# Altium schematic sheet MCU.SchDoc: Title
size A2; Date: Date; CompanyName: Integrated Micro-Electronics Bulgaria; Organization: Design & Development Department; Address1: Drawing Type; Address2: Address 1; Address3: Address 2; Address4: Address 3; DocumentNumber: 730xxx; Revision: 01; SheetNumber: 1; SheetTotal: 1; PageSetup: Record=PageOptions|CenterHorizontal=True|CenterVertical=True|PrintScale=0.70|XCorrection=1.00|YCorrection=1.00|PrintKind=2|BorderSize=5000000|LeftOffset=0|BottomOffset=0|Orientation=2|PaperLength=1000|PaperWidth=1000|Scale=100|PaperSource=7|PrintQuality=-4|MediaType=1|DitherType=10|PaperKind=A4|PrintScaleMode=1; SheetSize: A3; Time: Time; ModifiedDate: Mod. Date
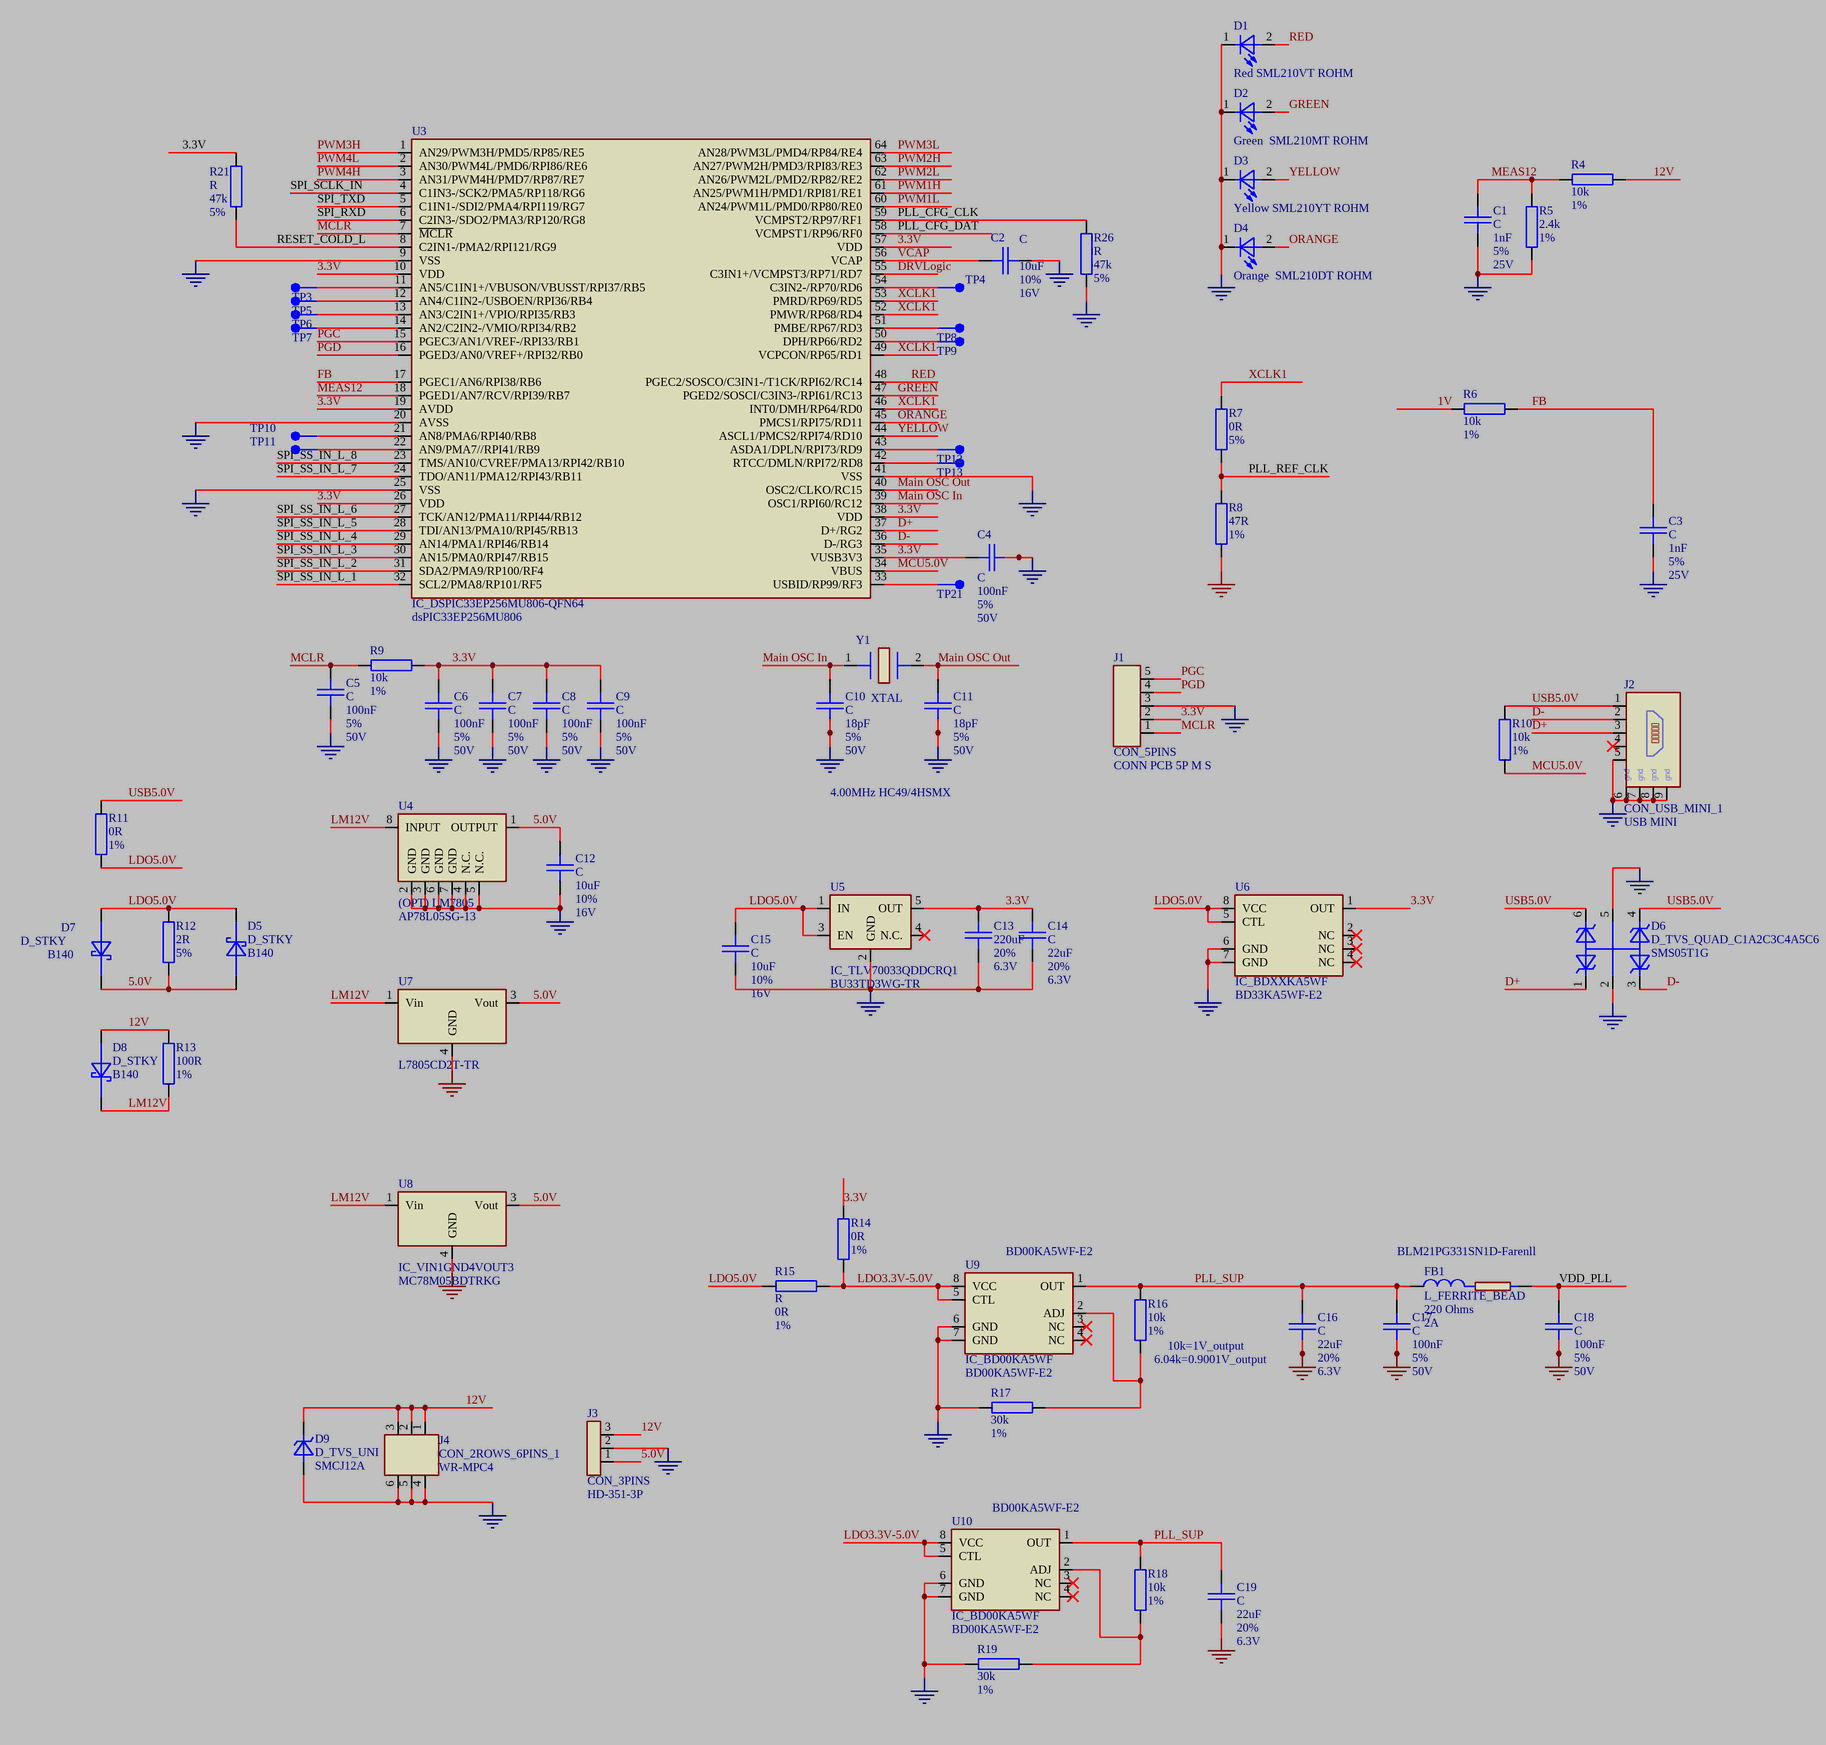
[diagram p0: MCU.SchDoc]

## Parts
C1  C  DB_VALUE: 1nF  DB_TOLERANCE: 5%  DB_VOLTAGE: 25V  [SMD_0603_CAPC1608X95N]
C2  C  DB_VALUE: 10uF  DB_TOLERANCE: 10%  DB_VOLTAGE: 16V  [SMD_0805_CAPC2012X145N]
C3  C  DB_VALUE: 1nF  DB_TOLERANCE: 5%  DB_VOLTAGE: 25V  [SMD_0603_CAPC1608X95N]
C4  C  DB_VALUE: 100nF  DB_TOLERANCE: 5%  DB_VOLTAGE: 50V  [SMD_0603_CAPC1608X95N]
C5  C  DB_VALUE: 100nF  DB_TOLERANCE: 5%  DB_VOLTAGE: 50V  [SMD_0603_CAPC1608X95N]
C6  C  DB_VALUE: 100nF  DB_TOLERANCE: 5%  DB_VOLTAGE: 50V  [SMD_0603_CAPC1608X95N]
C7  C  DB_VALUE: 100nF  DB_TOLERANCE: 5%  DB_VOLTAGE: 50V  [SMD_0603_CAPC1608X95N]
C8  C  DB_VALUE: 100nF  DB_TOLERANCE: 5%  DB_VOLTAGE: 50V  [SMD_0603_CAPC1608X95N]
C9  C  DB_VALUE: 100nF  DB_TOLERANCE: 5%  DB_VOLTAGE: 50V  [SMD_0603_CAPC1608X95N]
C10  C  DB_VALUE: 18pF  DB_TOLERANCE: 5%  DB_VOLTAGE: 50V  [SMD_0603_CAPC1608X95N]
C11  C  DB_VALUE: 18pF  DB_TOLERANCE: 5%  DB_VOLTAGE: 50V  [SMD_0603_CAPC1608X95N]
C12  C  DB_VALUE: 10uF  DB_TOLERANCE: 10%  DB_VOLTAGE: 16V  [SMD_0805_CAPC2012X145N]
C13  DB_VALUE: 220uF  DB_TOLERANCE: 20%  DB_VOLTAGE: 6.3V  [SMD_1210_CAPC3225X279N]  (hidden comment: C)
C14  C  DB_VALUE: 22uF  DB_TOLERANCE: 20%  DB_VOLTAGE: 6.3V  [SMD_0805_CAPC2012X145N]
C15  C  DB_VALUE: 10uF  DB_TOLERANCE: 10%  DB_VOLTAGE: 16V  [SMD_0805_CAPC2012X145N]
C16  C  DB_VALUE: 22uF  DB_TOLERANCE: 20%  DB_VOLTAGE: 6.3V  [SMD_0805_CAPC2012X145N]
C17  C  DB_VALUE: 100nF  DB_TOLERANCE: 5%  DB_VOLTAGE: 50V  [SMD_0603_CAPC1608X95N]
C18  C  DB_VALUE: 100nF  DB_TOLERANCE: 5%  DB_VOLTAGE: 50V  [SMD_0603_CAPC1608X95N]
C19  C  DB_VALUE: 22uF  DB_TOLERANCE: 20%  DB_VOLTAGE: 6.3V  [SMD_0805_CAPC2012X145N]
D1  Red SML210VT ROHM  [SMD_0805_LED2012X100N]
D2  Green 	SML210MT ROHM  [SMD_0805_LED2012X100N]
D3  Yellow SML210YT ROHM  [SMD_0805_LED2012X100N]
D4  Orange 	SML210DT ROHM  [SMD_0805_LED2012X100N]
D5  D_STKY  DB_VALUE: B140  [SMD_DO214AC_SMA]
D6  D_TVS_QUAD_C1A2C3C4A5C6  DB_VALUE: SMS05T1G  [SMD_SOT457_SOT95P275X110-6N]
D7  D_STKY  DB_VALUE: B140  [SMD_DO214AC_SMA]
D8  D_STKY  DB_VALUE: B140  [SMD_DO214AC_SMA]
D9  D_TVS_UNI  DB_VALUE: SMCJ12A  [SMD_DO214AC_SMC]
FB1  L_FERRITE_BEAD  DB_VALUE: 220 Ohms  DB_CURRENT: 2A  [SMD_0805_INDC2012X105N]
J1  CON_5PINS  DB_VALUE: CONN PCB 5P M S  [PTH_HDRV05W64P254_1X05]
J2  CON_USB_MINI_1  DB_VALUE: USB MINI  [SMD_CON-CVILUX-CU04-SCM15B0]
J3  CON_3PINS  DB_VALUE: HD-351-3P  [PTH_CON_HD-351-3P]
J4  CON_2ROWS_6PINS_1  DB_VALUE: WR-MPC4  [PTH_CON_WR-MRC4-6P]
R4  DB_VALUE: 10k  DB_TOLERANCE: 1%  [SMD_0603_RESC1608X55N]  (hidden comment: R)
R5  DB_VALUE: 2.4k  DB_TOLERANCE: 1%  [SMD_0603_RESC1608X55N]  (hidden comment: R)
R6  DB_VALUE: 10k  DB_TOLERANCE: 1%  [SMD_0603_RESC1608X55N]  (hidden comment: R)
R7  DB_VALUE: 0R  DB_TOLERANCE: 5%  [SMD_0603_RESC1608X55N]  (hidden comment: R)
R8  DB_VALUE: 47R  DB_TOLERANCE: 1%  [SMD_0603_RESC1608X55N]  (hidden comment: R)
R9  DB_VALUE: 10k  DB_TOLERANCE: 1%  [SMD_0603_RESC1608X55N]  (hidden comment: R)
R10  DB_VALUE: 10k  DB_TOLERANCE: 1%  [SMD_0603_RESC1608X55N]  (hidden comment: R)
R11  DB_VALUE: 0R  DB_TOLERANCE: 1%  [SMD_0603_RESC1608X55N]  (hidden comment: R)
R12  DB_VALUE: 2R  DB_TOLERANCE: 5%  [SMD_1206_RESC3216X65N]  (hidden comment: R)
R13  DB_VALUE: 100R  DB_TOLERANCE: 1%  [SMD_1206_RESC3216X65N]  (hidden comment: R)
R14  DB_VALUE: 0R  DB_TOLERANCE: 1%  [SMD_1206_RESC3216X65N]  (hidden comment: R)
R15  R  DB_VALUE: 0R  DB_TOLERANCE: 1%  [SMD_1206_RESC3216X65N]
R16  DB_VALUE: 10k  DB_TOLERANCE: 1%  [SMD_0603_RESC1608X55N]  (hidden comment: R)
R17  DB_VALUE: 30k  DB_TOLERANCE: 1%  [SMD_0603_RESC1608X55N]  (hidden comment: R)
R18  DB_VALUE: 10k  DB_TOLERANCE: 1%  [SMD_0603_RESC1608X55N]  (hidden comment: R)
R19  DB_VALUE: 30k  DB_TOLERANCE: 1%  [SMD_0603_RESC1608X55N]  (hidden comment: R)
R21  R  DB_VALUE: 47k  DB_TOLERANCE: 5%  [SMD_0603_RESC1608X55N]
R26  R  DB_VALUE: 47k  DB_TOLERANCE: 5%  [SMD_0603_RESC1608X55N]
TP3  TEST_POINT_1  [SMD_TP_100-254]  (value not drawn)
TP4  TEST_POINT_1  [SMD_TP_100-254]  (value not drawn)
TP5  TEST_POINT_1  [SMD_TP_100-254]  (value not drawn)
TP6  TEST_POINT_1  [SMD_TP_100-254]  (value not drawn)
TP7  TEST_POINT_1  [SMD_TP_100-254]  (value not drawn)
TP8  TEST_POINT_1  [SMD_TP_100-254]  (value not drawn)
TP9  TEST_POINT_1  [SMD_TP_100-254]  (value not drawn)
TP10  TEST_POINT_1  [SMD_TP_100-254]  (value not drawn)
TP11  TEST_POINT_1  [SMD_TP_100-254]  (value not drawn)
TP12  TEST_POINT_1  [SMD_TP_100-254]  (value not drawn)
TP13  TEST_POINT_1  [SMD_TP_100-254]  (value not drawn)
TP21  TEST_POINT_1  [SMD_TP_100-254]  (value not drawn)
U3  IC_DSPIC33EP256MU806-QFN64  DB_VALUE: dsPIC33EP256MU806  [SMD_QFP50P1200X1200X120-64N]
U4  (OPT) LM7805  DB_VALUE: AP78L05SG-13  [SMD_SOIC127P600X175-8N]
U5  IC_TLV70033QDDCRQ1  DB_VALUE: BU33TD3WG-TR  [SMD_SOT95P280X135-5N]
U6  IC_BDXXKA5WF  DB_VALUE: BD33KA5WF-E2  [SMD_SOIC127P620X160-8N]
U7  DB_VALUE: L7805CD2T-TR  [SMD_TO254P1542X460-3_4N]  (hidden comment: IC_IN1OUT3GND4)
U8  IC_VIN1GND4VOUT3  DB_VALUE: MC78M05BDTRKG  [SMD_TO229P991X239-4N_DPAK]
U9  IC_BD00KA5WF  DB_VALUE: BD00KA5WF-E2  [SMD_SOIC127P620X160-8N]
U10  IC_BD00KA5WF  DB_VALUE: BD00KA5WF-E2  [SMD_SOIC127P620X160-8N]
Y1  XTAL  DB_VALUE: 4.00MHz HC49/4HSMX  [SMD_HC49_XTAL1140X480X420N]

## Nets
GND: C1.2 C2.2 C3.2 C4.2 C5.2 C6.2 C7.2 C8.2 C9.2 C10.2 C11.2 C12.2 C13.1 C14.2 C15.2 C16.2 C17.2 C18.2 C19.2 D1.1(C) D2.1(C) D3.1(C) D4.1(C) D6.2 D6.5 D9.2(A) J1.3 J2.5 J2.6 J2.7 J2.8 J2.9 J3.2 J4.4 J4.5 J4.6 R5.1 R8.2 R17.2 R19.2 R26.2 U3.9(VSS) U3.20(AVSS) U3.25(VSS) U3.41(VSS) U4.2(GND) U4.3(GND) U4.4(N.C.) U4.5(N.C.) U4.6(GND) U4.7(GND) U5.2(GND) U6.6(GND) U6.7(GND) U7.4(GND) U8.4(GND) U9.6(GND) U9.7(GND) U10.6(GND) U10.7(GND)
1V: R6.2
3.3V: C4.1 C6.1 C7.1 C8.1 C9.1 C13.2 C14.1 J1.2 R9.2 R14.2 R21.1 U3.10(VDD) U3.19(AVDD) U3.26(VDD) U3.35(VUSB3V3) U3.38(VDD) U3.57(VDD) U5.5(OUT) U6.1(OUT)
5.0V: C12.1 D5.2(A) D7.1(C) J3.1 R12.1 U4.1(OUTPUT) U7.3(Vout) U8.3(Vout)
12V: D8.2(A) D9.1(C) J3.3 J4.1 J4.2 J4.3 R4.1 R13.2
D+: D6.1 J2.3 U3.37(D+/RG2)
D-: D6.3 J2.2 U3.36(D-/RG3)
DRVLogic: U3.55(C3IN1+/VCMPST3/RP71/RD7)
FB: C3.1 R6.1 U3.17(PGEC1/AN6/RPI38/RB6)
GREEN: D2.2(A) U3.47(PGED2/SOSCI/C3IN3-/RPI61/RC13)
LDO3.3V-5.0V: R14.1 R15.1 U9.5(CTL) U9.8(VCC) U10.5(CTL) U10.8(VCC)
LDO5.0V: C15.1 D5.1(C) D7.2(A) R11.1 R12.2 R15.2 U5.1(IN) U5.3(EN) U6.5(CTL) U6.8(VCC)
LM12V: D8.1(C) R13.1 U4.8(INPUT) U7.1(Vin) U8.1(Vin)
Main OSC In: C10.1 U3.39(OSC1/RPI60/RC12) Y1.1
Main OSC Out: C11.1 U3.40(OSC2/CLKO/RC15) Y1.2
MCLR: C5.1 J1.1 R9.1 U3.7(~{MCLR})
MCU5.0V: R10.2 U3.34(VBUS)
MEAS12: C1.1 R4.2 R5.2 U3.18(PGED1/AN7/RCV/RPI39/RB7)
ORANGE: D4.2(A) U3.45(PMCS1/RPI75/RD11)
PGC: J1.5 U3.15(PGEC3/AN1/VREF-/RPI33/RB1)
PGD: J1.4 U3.16(PGED3/AN0/VREF+/RPI32/RB0)
PLL_CFG_CLK: R26.1 U3.59(VCMPST2/RP97/RF1)
PLL_CFG_DAT: U3.58(VCMPST1/RP96/RF0)
PLL_REF_CLK: R7.1 R8.1
PLL_SUP: C16.1 C17.1 C19.1 FB1.1 R16.1 R18.1 U9.1(OUT) U10.1(OUT)
PWM1H: U3.61(AN25/PWM1H/PMD1/RPI81/RE1)
PWM1L: U3.60(AN24/PWM1L/PMD0/RP80/RE0)
PWM2H: U3.63(AN27/PWM2H/PMD3/RPI83/RE3)
PWM2L: U3.62(AN26/PWM2L/PMD2/RP82/RE2)
PWM3H: U3.1(AN29/PWM3H/PMD5/RP85/RE5)
PWM3L: U3.64(AN28/PWM3L/PMD4/RP84/RE4)
PWM4H: U3.3(AN31/PWM4H/PMD7/RP87/RE7)
PWM4L: U3.2(AN30/PWM4L/PMD6/RPI86/RE6)
RED: D1.2(A) U3.48(PGEC2/SOSCO/C3IN1-/T1CK/RPI62/RC14)
RESET_COLD_L: R21.2 U3.8(C2IN1-/PMA2/RPI121/RG9)
SPI_RXD: U3.6(C2IN3-/SDO2/PMA3/RP120/RG8)
SPI_SCLK_IN: U3.4(C1IN3-/SCK2/PMA5/RP118/RG6)
SPI_SS_IN_L_1: U3.32(SCL2/PMA8/RP101/RF5)
SPI_SS_IN_L_2: U3.31(SDA2/PMA9/RP100/RF4)
SPI_SS_IN_L_3: U3.30(AN15/PMA0/RPI47/RB15)
SPI_SS_IN_L_4: U3.29(AN14/PMA1/RPI46/RB14)
SPI_SS_IN_L_5: U3.28(TDI/AN13/PMA10/RPI45/RB13)
SPI_SS_IN_L_6: U3.27(TCK/AN12/PMA11/RPI44/RB12)
SPI_SS_IN_L_7: U3.24(TDO/AN11/PMA12/RPI43/RB11)
SPI_SS_IN_L_8: U3.23(TMS/AN10/CVREF/PMA13/RPI42/RB10)
SPI_TXD: U3.5(C1IN1-/SDI2/PMA4/RPI119/RG7)
USB5.0V: D6.4 D6.6 J2.1 R10.1 R11.2
VCAP: C2.1 U3.56(VCAP)
VDD_PLL: C18.1 FB1.2
XCLK1: R7.2 U3.46(INT0/DMH/RP64/RD0) U3.49(VCPCON/RP65/RD1) U3.52(PMWR/RP68/RD4) U3.53(PMRD/RP69/RD5)
YELLOW: D3.2(A) U3.44(ASCL1/PMCS2/RPI74/RD10)
NetR16_2: R16.2 R17.1 U9.2(ADJ)
NetR18_2: R18.2 R19.1 U10.2(ADJ)
NetTP3_1: TP3.1 U3.11(AN5/C1IN1+/VBUSON/VBUSST/RPI37/RB5)
NetTP4_1: TP4.1 U3.54(C3IN2-/RP70/RD6)
NetTP5_1: TP5.1 U3.12(AN4/C1IN2-/USBOEN/RPI36/RB4)
NetTP6_1: TP6.1 U3.13(AN3/C2IN1+/VPIO/RPI35/RB3)
NetTP7_1: TP7.1 U3.14(AN2/C2IN2-/VMIO/RPI34/RB2)
NetTP8_1: TP8.1 U3.51(PMBE/RP67/RD3)
NetTP9_1: TP9.1 U3.50(DPH/RP66/RD2)
NetTP10_1: TP10.1 U3.21(AN8/PMA6/RPI40/RB8)
NetTP11_1: TP11.1 U3.22(AN9/PMA7//RPI41/RB9)
NetTP12_1: TP12.1 U3.43(ASDA1/DPLN/RPI73/RD9)
NetTP13_1: TP13.1 U3.42(RTCC/DMLN/RPI72/RD8)
NetTP21_1: TP21.1 U3.33(USBID/RP99/RF3)

Not connected (* = marked no-connect by the designer): J2 4*; U5 4(N.C.)*; U6 2(NC)* 3(NC)* 4(NC)*; U9 3(NC)* 4(NC)*; U10 3(NC)* 4(NC)*

## Notes on the sheet
- (near U9) BD00KA5WF-E2
- (near FB1) BLM21PG331SN1D-Farenll
- 6.04k=0.9001V_output
- (near R16) 10k=1V_output
- (near U10) BD00KA5WF-E2
- (in symbol CON000000048) gnd

## Library data of the parts
C1 C3 = CAP000024113: DB_PART_TYPE: Ceramic_SMD\Standard_X7R; DB_MANUFACTURER_PART: KEMET    C0603C102J3RAC; NOTE: <NOTE>; DB_T_RANGE: -55 to 125; DB_PACKAGE: 0603; DB_DESCRIPTION: C X7R 1nF 5% 25V 0603; DB_CERTIFIED: ISHIDDEN=T; DB_STATUS: NEW; DB_PART_NUMBER: CAP000024113; DB_PCB_DEVICE: SMD_0603_CAPC1608X95N; DB_PRICE: ISHIDDEN=T; DB_LEADTIME: ISHIDDEN=T; DB_MOQ: ISHIDDEN=T; DB_PRICE_DATE: ISHIDDEN=T; DB_APPROVED_BY: ISHIDDEN=T; DB_APPROVED_ON: 09.10.2010; DB_DATASHEET: http://john.epiqdesign.com/projects/CIS_Datasheets/F3102_CE_Kemet.pdf?rev=92&sc=0
C2 C12 C15 = CAP000043636: DB_PART_TYPE: Ceramic_SMD\Standard_X5R; DB_MANUFACTURER_PART: KEMET    C0805C106K4PAC; NOTE: <NOTE>; DB_T_RANGE: -55 to 85; DB_PACKAGE: 0805; DB_DESCRIPTION: C X5R 10uF 10% 16V 0805; DB_CERTIFIED: ISHIDDEN=T; DB_STATUS: NEW; DB_PART_NUMBER: CAP000043636; DB_PCB_DEVICE: SMD_0805_CAPC2012X145N; DB_PRICE: ISHIDDEN=T; DB_LEADTIME: ISHIDDEN=T; DB_MOQ: ISHIDDEN=T; DB_PRICE_DATE: ISHIDDEN=T; DB_APPROVED_BY: ISHIDDEN=T; DB_APPROVED_ON: 09.10.2010; DB_DATASHEET: http://john.epiqdesign.com/projects/CIS_Datasheets/F3102_CE_Kemet.pdf?rev=92&sc=0
C4-C9 C17 C18 = CAP000027136: DB_PART_TYPE: Ceramic_SMD\Standard_X7R; DB_MANUFACTURER_PART: KEMET    C0603C104J5RAC; NOTE: <NOTE>; DB_T_RANGE: -55 to 125; DB_PACKAGE: 0603; DB_DESCRIPTION: C X7R 100nF 5% 50V 0603; DB_CERTIFIED: ISHIDDEN=T; DB_STATUS: NEW; DB_PART_NUMBER: CAP000027136; DB_PCB_DEVICE: SMD_0603_CAPC1608X95N; DB_PRICE: ISHIDDEN=T; DB_LEADTIME: ISHIDDEN=T; DB_MOQ: ISHIDDEN=T; DB_PRICE_DATE: ISHIDDEN=T; DB_APPROVED_BY: ISHIDDEN=T; DB_APPROVED_ON: 09.10.2010; DB_DATASHEET: http://john.epiqdesign.com/projects/CIS_Datasheets/F3102_CE_Kemet.pdf?rev=92&sc=0
C10 C11 = CAP000031922: DB_PART_TYPE: Ceramic_SMD\Standard_C0G; DB_MANUFACTURER_PART: KEMET    C0603C180J5GAC; NOTE: <NOTE>; DB_T_RANGE: -55 to 125; DB_PACKAGE: 0603; DB_DESCRIPTION: C C0G 18pF 5% 50V 0603; DB_CERTIFIED: ISHIDDEN=T; DB_STATUS: NEW; DB_PART_NUMBER: CAP000031922; DB_PCB_DEVICE: SMD_0603_CAPC1608X95N; DB_PRICE: ISHIDDEN=T; DB_LEADTIME: ISHIDDEN=T; DB_MOQ: ISHIDDEN=T; DB_PRICE_DATE: ISHIDDEN=T; DB_APPROVED_BY: ISHIDDEN=T; DB_APPROVED_ON: 09.10.2010; DB_DATASHEET: http://john.epiqdesign.com/projects/CIS_Datasheets/F3102_CE_Kemet.pdf?rev=92&sc=0
C13 = CAP000047355: DB_PART_TYPE: Ceramic_SMD\Standard_X5R; DB_MANUFACTURER_PART: SAMSUNG    CL32A227MQVNNNE; NOTE: <NOTE>; DB_T_RANGE: -55 to 85; DB_PACKAGE: 1210; DB_DESCRIPTION: C X5R 220uF 20% 6.3V 1210; DB_CERTIFIED: ISHIDDEN=T; DB_APPROVED_BY: VSN; DB_STATUS: NEW; DB_PART_NUMBER: CAP000047355; DB_PCB_DEVICE: SMD_1210_CAPC3225X279N; DB_APPROVED_ON: 07.05.2014 11:28:08; DB_DATASHEET: http://john.epiqdesign.com/projects/CIS_Datasheets/CAP_CL32A227MQVNNNE.pdf?rev=1401&sc=0
C14 C16 C19 = CAP000043686: DB_PART_TYPE: Ceramic_SMD\Standard_X5R; DB_MANUFACTURER_PART: KEMET    C0805C226M9PAC; NOTE: <NOTE>; DB_T_RANGE: -55 to 85; DB_PACKAGE: 0805; DB_DESCRIPTION: C X5R 22uF 20% 6.3V 0805; DB_CERTIFIED: ISHIDDEN=T; DB_STATUS: NEW; DB_PART_NUMBER: CAP000043686; DB_PCB_DEVICE: SMD_0805_CAPC2012X145N; DB_PRICE: ISHIDDEN=T; DB_LEADTIME: ISHIDDEN=T; DB_MOQ: ISHIDDEN=T; DB_PRICE_DATE: ISHIDDEN=T; DB_APPROVED_BY: ISHIDDEN=T; DB_APPROVED_ON: 09.10.2010; DB_DATASHEET: http://john.epiqdesign.com/projects/CIS_Datasheets/F3102_CE_Kemet.pdf?rev=92&sc=0
D1-D4 = LED_2: NOTE: <NOTE>; DB_PCB_DEVICE: SMD_0805_LED2012X100N
D5 D7 D8 = DDE000000580: DB_PART_TYPE: Schottky; DB_MANUFACTURER_PART: Diodes        B140; NOTE: <NOTE>; DB_T_RANGE: -65 to +150; DB_VOLTAGE: 40V; DB_CURRENT: 1A; DB_PACKAGE: SMA; DB_DESCRIPTION: D B140 SMA; DB_CERTIFIED: ISHIDDEN=T; DB_STATUS: NEW; DB_PART_NUMBER: DDE000000580; DB_PCB_DEVICE: SMD_DO214AC_SMA; DB_PRICE: ISHIDDEN=T; DB_LEADTIME: ISHIDDEN=T; DB_MOQ: ISHIDDEN=T; DB_PRICE_DATE: ISHIDDEN=T; DB_APPROVED_BY: ISHIDDEN=T; DB_APPROVED_ON: 09.10.2010; DB_DATASHEET: ISHIDDEN=T
D6 = DDE000002846: DB_PART_TYPE: ESD protection; DB_MANUFACTURER_PART: ON SEMICONDUCTOR        SMS05T1G; DB_T_RANGE: -55 to 150; DB_VOLTAGE: 5V; DB_PACKAGE: SC-74; DB_DESCRIPTION: D SMS05T1G SC-74; DB_CERTIFIED: ISHIDDEN=T; DB_APPROVED_BY: VSN; DB_STATUS: NEW; DB_PART_NUMBER: DDE000002846; DB_PCB_DEVICE: SMD_SOT457_SOT95P275X110-6N; DB_APPROVED_ON: 24.03.2014 10:22:08; DB_DATASHEET: http://john.epiqdesign.com/projects/CIS_Datasheets/IC_SMS05T1-D.pdf?rev=1323&sc=0
D9 = DDE000001725: DB_PART_TYPE: TVS; DB_MANUFACTURER_PART: Diodes        SMCJ12A; NOTE: <NOTE>; DB_T_RANGE: -55 to 150; DB_VOLTAGE: 12V; DB_CURRENT: 75A(Max); DB_PACKAGE: SMC; DB_DESCRIPTION: D SMCJ12A SMC; DB_CERTIFIED: ISHIDDEN=T; DB_STATUS: NEW; DB_PART_NUMBER: DDE000001725; DB_PCB_DEVICE: SMD_DO214AC_SMC; DB_PRICE: ISHIDDEN=T; DB_LEADTIME: ISHIDDEN=T; DB_MOQ: ISHIDDEN=T; DB_PRICE_DATE: ISHIDDEN=T; DB_APPROVED_BY: ISHIDDEN=T; DB_APPROVED_ON: 09.10.2010; DB_DATASHEET: ISHIDDEN=T
FB1 = IND000000029: DB_PART_TYPE: Inductor; DB_MANUFACTURER_PART: MURATA       BLM21PG221SN1D; NOTE: <NOTE>; DB_TOLERANCE: 25%; DB_T_RANGE: -55 to 125; DB_PACKAGE: 0805; DB_DESCRIPTION: INDUC 220 Ohms 25% 0805; DB_CERTIFIED: ISHIDDEN=T; DB_APPROVED_BY: VSN; DB_STATUS: NEW; DB_PART_NUMBER: IND000000029; DB_PCB_DEVICE: SMD_0805_INDC2012X105N; DB_PRICE: ISHIDDEN=T; DB_LEADTIME: ISHIDDEN=T; DB_MOQ: ISHIDDEN=T; DB_PRICE_DATE: ISHIDDEN=T; DB_APPROVED_ON: 30.06.2011 07:59:29; DB_DATASHEET: http://john.epiqdesign.com/projects/CIS_Datasheets/BLM21P_MURATA.pdf?rev=325&sc=0
J1 = CON000000006: DB_PART_TYPE: Connector; DB_MANUFACTURER_PART: W+P        143-12-005-00; NOTE: <NOTE>; DB_PINS_NUMBER: ISHIDDEN=T; DB_T_RANGE: -55 to 125; DB_PACKAGE: PTH; DB_DESCRIPTION: CONN PCB 5P M S 143-12-005-00; DB_APPROVED_BY: VSN; DB_STATUS: NEW; DB_PART_NUMBER: CON000000006; DB_PITCH: ISHIDDEN=T; DB_VOLTAGE: ISHIDDEN=T; DB_CURRENT: ISHIDDEN=T; DB_IP_CLASS: ISHIDDEN=T; DB_PCB_DEVICE: PTH_HDRV05W64P254_1X05; DB_CERTIFIED: ISHIDDEN=T; DB_PRICE: ISHIDDEN=T; DB_LEADTIME: ISHIDDEN=T; DB_MOQ: ISHIDDEN=T; DB_PRICE_DATE: ISHIDDEN=T; DB_APPROVED_ON: 14.12.2010 10:22:07; DB_DATASHEET: http://john.epiqdesign.com/projects/CIS_Datasheets/143-12-005-00_W+P.pdf?rev=3&sc=0
J2 = CON000000048: DB_PART_TYPE: Connector; DB_MANUFACTURER_PART: CVILUX       CU04-SCM15B0-R0-LF; NOTE: <NOTE>; DB_PINS_NUMBER: 5; DB_PITCH: 0.8; DB_PACKAGE: SMD; DB_DESCRIPTION: CONN  PCB  5P  F  A  USB5 MINI SMD; DB_CERTIFIED: ISHIDDEN=T; DB_APPROVED_BY: VSN; DB_STATUS: NEW; DB_PART_NUMBER: CON000000048; DB_PCB_DEVICE: SMD_CON-CVILUX-CU04-SCM15B0; DB_PRICE: ISHIDDEN=T; DB_LEADTIME: ISHIDDEN=T; DB_MOQ: ISHIDDEN=T; DB_PRICE_DATE: ISHIDDEN=T; DB_APPROVED_ON: 02.05.2011 10:29:38; DB_DATASHEET: http://john.epiqdesign.com/projects/CIS_Datasheets/USB%20MINI_CVILUX.pdf?rev=249&sc=0
J3 = CON000000272: DB_PART_TYPE: Connector; DB_MANUFACTURER_PART: HOW DER      HD-351-3P; DB_PINS_NUMBER: 3; DB_PITCH: 3.5mm; DB_VOLTAGE: 300VAC; DB_CURRENT: 10A; DB_PACKAGE: PTH; DB_DESCRIPTION: CONN PCB 3P; DB_CERTIFIED: ISHIDDEN=T; DB_APPROVED_BY: VSN; DB_STATUS: NEW; DB_PART_NUMBER: CON000000272; DB_PCB_DEVICE: PTH_CON_HD-351-3P; DB_APPROVED_ON: 07.05.2014 14:06:04; DB_DATASHEET: http://john.epiqdesign.com/projects/CIS_Datasheets/CON_hd-351.pdf?rev=1413&sc=0
J4 = CON000000271: DB_PART_TYPE: Connector; DB_MANUFACTURER_PART: WE         649 006 295 22; DB_PINS_NUMBER: 6; DB_PITCH: 4.2mm; DB_T_RANGE: -40 to 105; DB_VOLTAGE: 600VAC; DB_CURRENT: 6 - 9A; DB_PACKAGE: PTH; DB_DESCRIPTION: CONN PCB 6P M A PTH; DB_CERTIFIED: ISHIDDEN=T; DB_APPROVED_BY: VSN; DB_STATUS: NEW; DB_PART_NUMBER: CON000000271; DB_PCB_DEVICE: PTH_CON_WR-MRC4-6P; DB_APPROVED_ON: 07.05.2014 13:56:56; DB_DATASHEET: http://john.epiqdesign.com/projects/CIS_Datasheets/CON_WR-MPC4.pdf?rev=1412&sc=0
R4 R6 R9 R10 R16 R18 = RES000008663: DB_PART_TYPE: SMD; DB_MANUFACTURER_PART: YAGEO    RC0603FR-0710KL; NOTE: <NOTE>; DB_T_RANGE: -55 to 155; DB_POWER: 1/10W; DB_PACKAGE: 0603; DB_DESCRIPTION: R SMD 10k 1% 1/10W 0603; DB_CERTIFIED: ISHIDDEN=T; DB_APPROVED_BY: VSN; DB_STATUS: NEW; R_BDS: R; DB_PART_NUMBER: RES000008663; DB_PCB_DEVICE: SMD_0603_RESC1608X55N; DB_PRICE: ISHIDDEN=T; DB_LEADTIME: ISHIDDEN=T; DB_MOQ: ISHIDDEN=T; DB_PRICE_DATE: ISHIDDEN=T; DB_APPROVED_ON: 08.08.2011 08:31:51; DB_DATASHEET: http://john.epiqdesign.com/projects/CIS_Datasheets/PYu-RC0603_51_RoHS_L_4_YAGEO.pdf?rev=138&sc=0
R5 = RES000006261: DB_PART_TYPE: SMD; DB_MANUFACTURER_PART: YAGEO    RC0603FR-072K4; NOTE: <NOTE>; DB_T_RANGE: -55 to 155; DB_POWER: 1/10W; DB_PACKAGE: 0603; DB_DESCRIPTION: R SMD 2K4 1% 1/10W 0603; DB_CERTIFIED: ISHIDDEN=T; DB_PRICE: 0.00063; DB_MOQ: 5000; DB_STATUS: NEW; R_BDS: R; DB_PART_NUMBER: RES000006261; DB_PCB_DEVICE: SMD_0603_RESC1608X55N; DB_PRICE_DATE: 2010-12-23; DB_APPROVED_BY: ISHIDDEN=T; DB_APPROVED_ON: 09.10.2010; DB_DATASHEET: http://john.epiqdesign.com/projects/CIS_Datasheets/PYu-RC0603_51_RoHS_L_4_YAGEO.pdf?rev=138&sc=0
R7 = RES000006349: DB_PART_TYPE: SMD; DB_MANUFACTURER_PART: YAGEO    RC0603JR-070R; NOTE: <NOTE>; DB_T_RANGE: -55 to 155; DB_POWER: 1/10W; DB_PACKAGE: 0603; DB_DESCRIPTION: R SMD 0R 5% 1/10W 0603; DB_PRICE: 0.000364; DB_MOQ: 5000; DB_STATUS: NEW; R_BDS: R; DB_PART_NUMBER: RES000006349; DB_PCB_DEVICE: SMD_0603_RESC1608X55N; DB_PRICE_DATE: 2010-12-23; DB_APPROVED_ON: 09.10.2010; DB_DATASHEET: http://john.epiqdesign.com/projects/CIS_Datasheets/PYu-RC0603_51_RoHS_L_4_YAGEO.pdf?rev=138&sc=0
R8 = RES000006220: DB_PART_TYPE: SMD; DB_MANUFACTURER_PART: YAGEO    RC0603FR-0747R; NOTE: <NOTE>; DB_T_RANGE: -55 to 155; DB_POWER: 1/10W; DB_PACKAGE: 0603; DB_DESCRIPTION: R SMD 47R 1% 1/10W 0603; DB_CERTIFIED: ISHIDDEN=T; DB_PRICE: 0.00063; DB_MOQ: 5000; DB_STATUS: NEW; R_BDS: R; DB_PART_NUMBER: RES000006220; DB_PCB_DEVICE: SMD_0603_RESC1608X55N; DB_PRICE_DATE: 2010-12-23; DB_APPROVED_BY: ISHIDDEN=T; DB_APPROVED_ON: 09.10.2010; DB_DATASHEET: http://john.epiqdesign.com/projects/CIS_Datasheets/PYu-RC0603_51_RoHS_L_4_YAGEO.pdf?rev=138&sc=0
R11 = RES000008926: DB_PART_TYPE: SMD; DB_MANUFACTURER_PART: YAGEO    AC0603FR-070RL; NOTE: <NOTE>; DB_T_RANGE: -55 to 155; DB_POWER: 1/10W; DB_PACKAGE: 0603; DB_DESCRIPTION: R SMD 0R 1% 1/10W 0603; DB_CERTIFIED: AUT; DB_APPROVED_BY: VSN; DB_STATUS: NEW; R_BDS: R; DB_PART_NUMBER: RES000008926; DB_PCB_DEVICE: SMD_0603_RESC1608X55N; DB_APPROVED_ON: 21.05.2013 09:19:53; DB_DATASHEET: http://john.epiqdesign.com/projects/CIS_Datasheets/RES_AC_YAGEO.pdf?rev=263&sc=0
R12 = RES000007051: DB_PART_TYPE: SMD; DB_MANUFACTURER_PART: YAGEO    RC1206JR-072R; NOTE: <NOTE>; DB_T_RANGE: -55 to 155; DB_POWER: 1/4W; DB_PACKAGE: 1206; DB_DESCRIPTION: R SMD 2R 5% 1/4W 1206; DB_CERTIFIED: ISHIDDEN=T; DB_STATUS: NEW; R_BDS: R; DB_PART_NUMBER: RES000007051; DB_PCB_DEVICE: SMD_1206_RESC3216X65N; DB_PRICE: ISHIDDEN=T; DB_LEADTIME: ISHIDDEN=T; DB_MOQ: ISHIDDEN=T; DB_PRICE_DATE: ISHIDDEN=T; DB_APPROVED_BY: ISHIDDEN=T; DB_APPROVED_ON: 09.10.2010; DB_DATASHEET: http://john.epiqdesign.com/projects/CIS_Datasheets/PYu-RC1206_51_RoHS_L_4_YAGEO.pdf?rev=138&sc=0
R13 = RES000006922: DB_PART_TYPE: SMD; DB_MANUFACTURER_PART: YAGEO    RC1206FR-07100R; NOTE: <NOTE>; DB_T_RANGE: -55 to 155; DB_POWER: 1/4W; DB_PACKAGE: 1206; DB_DESCRIPTION: R SMD 100R 1% 1/4W 1206; DB_CERTIFIED: ISHIDDEN=T; DB_STATUS: NEW; R_BDS: R; DB_PART_NUMBER: RES000006922; DB_PCB_DEVICE: SMD_1206_RESC3216X65N; DB_PRICE: ISHIDDEN=T; DB_LEADTIME: ISHIDDEN=T; DB_MOQ: ISHIDDEN=T; DB_PRICE_DATE: ISHIDDEN=T; DB_APPROVED_BY: ISHIDDEN=T; DB_APPROVED_ON: 09.10.2010; DB_DATASHEET: http://john.epiqdesign.com/projects/CIS_Datasheets/PYu-RC1206_51_RoHS_L_4_YAGEO.pdf?rev=138&sc=0
R14 R15 = RES000008756: DB_PART_TYPE: SMD; DB_MANUFACTURER_PART: YAGEO    AC1206FR-070RL; NOTE: <NOTE>; DB_T_RANGE: -55 to 155; DB_POWER: 1/4W; DB_PACKAGE: 1206; DB_DESCRIPTION: R SMD 0R 1% 1/4W 1206; DB_CERTIFIED: AUT; DB_PRICE: ISHIDDEN=T; DB_APPROVED_BY: VSN; DB_STATUS: NEW; R_BDS: R; DB_PART_NUMBER: RES000008756; DB_PCB_DEVICE: SMD_1206_RESC3216X65N; DB_LEADTIME: ISHIDDEN=T; DB_MOQ: ISHIDDEN=T; DB_PRICE_DATE: ISHIDDEN=T; DB_APPROVED_ON: 27.04.2012 12:25:00; DB_DATASHEET: http://john.epiqdesign.com/projects/CIS_Datasheets/RES_AC_YAGEO.pdf?rev=263&sc=0
R17 R19 = RES000006287: DB_PART_TYPE: SMD; DB_MANUFACTURER_PART: YAGEO    RC0603FR-0730K; NOTE: <NOTE>; DB_T_RANGE: -55 to 155; DB_POWER: 1/10W; DB_PACKAGE: 0603; DB_DESCRIPTION: R SMD 30K 1% 1/10W 0603; DB_CERTIFIED: ISHIDDEN=T; DB_PRICE: 0.00063; DB_MOQ: 5000; DB_STATUS: NEW; R_BDS: R; DB_PART_NUMBER: RES000006287; DB_PCB_DEVICE: SMD_0603_RESC1608X55N; DB_PRICE_DATE: 2010-12-23; DB_APPROVED_BY: ISHIDDEN=T; DB_APPROVED_ON: 09.10.2010; DB_DATASHEET: http://john.epiqdesign.com/projects/CIS_Datasheets/PYu-RC0603_51_RoHS_L_4_YAGEO.pdf?rev=138&sc=0
R21 R26 = RES000006462: DB_PART_TYPE: SMD; DB_MANUFACTURER_PART: YAGEO    RC0603JR-0747K; NOTE: <NOTE>; DB_T_RANGE: -55 to 155; DB_POWER: 1/10W; DB_PACKAGE: 0603; DB_DESCRIPTION: R SMD 47K 5% 1/10W 0603; DB_PRICE: 0.000364; DB_MOQ: 5000; DB_STATUS: NEW; R_BDS: R; DB_PART_NUMBER: RES000006462; DB_PCB_DEVICE: SMD_0603_RESC1608X55N; DB_PRICE_DATE: 2010-12-23; DB_APPROVED_ON: 09.10.2010; DB_DATASHEET: http://john.epiqdesign.com/projects/CIS_Datasheets/PYu-RC0603_51_RoHS_L_4_YAGEO.pdf?rev=138&sc=0
TP3-TP13 TP21 = TPO000000001: DB_PART_TYPE: Test Point; DB_VALUE: 100_254; DB_PACKAGE: ISHIDDEN=T; DB_DESCRIPTION: Test Point 100_254; DB_STATUS: NEW; DB_PART_NUMBER: TPO000000001; DB_DIAMETER: 100_254; DB_PCB_DEVICE: SMD_TP_100-254; DB_MANUFACTURER_PART: ISHIDDEN=T; DB_CERTIFIED: ISHIDDEN=T; DB_PRICE: ISHIDDEN=T; DB_LEADTIME: ISHIDDEN=T; DB_MOQ: ISHIDDEN=T; DB_PRICE_DATE: ISHIDDEN=T; DB_APPROVED_BY: ISHIDDEN=T; DB_APPROVED_ON: 10.09.2010; DB_DATASHEET: ISHIDDEN=T
U3 = MCU000000070: DB_PART_TYPE: DSP; DB_MANUFACTURER_PART: MICROCHIP        DSPIC33EP256MU806-E/PT; OriginalSymbolOrigin: (30000,20000); < Value >: Type; DeviceNumbering: Alpha; DeviceDesignator: A; DevicesInPackage: 1; IsHeterogeneous: False; DB_T_RANGE: -40 to 125; DB_PACKAGE: TQFP-64; DB_DESCRIPTION: IC dsPIC33EP256MU806 TQFP-64; DB_CERTIFIED: AUT; DB_PRICE: ISHIDDEN=T; DB_APPROVED_BY: VSN; DB_STATUS: NEW; Package: <Package>; DevicesInView: 1; PackageName: PIC24FJ16GA004_X_PT; DB_PART_NUMBER: MCU000000070; DB_PCB_DEVICE: SMD_QFP50P1200X1200X120-64N; DB_LEADTIME: ISHIDDEN=T; DB_MOQ: ISHIDDEN=T; DB_PRICE_DATE: ISHIDDEN=T; DB_APPROVED_ON: 17.07.2012 14:21:28; DB_DATASHEET: http://john.epiqdesign.com/projects/CIS_Datasheets/dsPIC33EPxxx-Microchip.pdf?rev=798&sc=0
U4 = PSU000000125: DB_PART_TYPE: Linear Voltage Regulator; DB_MANUFACTURER_PART: DIODES        AP78L05SG-13; DB_T_RANGE: -40 to 125; DB_VOLTAGE: 5V; DB_CURRENT: 100mA; DB_PACKAGE: SOIC-8; DB_DESCRIPTION: IC AP78L05SG-13 SOIC-8; DB_CERTIFIED: ISHIDDEN=T; DB_APPROVED_BY: VSN; DB_STATUS: NEW; DB_PART_NUMBER: PSU000000125; DB_PCB_DEVICE: SMD_SOIC127P600X175-8N; DB_APPROVED_ON: 07.05.2014 12:58:07; DB_DATASHEET: http://john.epiqdesign.com/projects/CIS_Datasheets/IC_AP78LXX.pdf?rev=1405&sc=0
U5 = PSU000000126: DB_PART_TYPE: Linear Voltage Regulator; DB_MANUFACTURER_PART: ROHM     BU33TD3WG-TR; DB_T_RANGE: -40 to 85; DB_VOLTAGE: 3.3V; DB_CURRENT: 200mA; DB_DROP_VOLTAGE: 220mV; DB_PACKAGE: SOT23-5; DB_DESCRIPTION: IC BU33TD3WG-TR SOT23-5; DB_CERTIFIED: ISHIDDEN=T; DB_APPROVED_BY: VSN; DB_STATUS: NEW; DB_PART_NUMBER: PSU000000126; DB_PCB_DEVICE: SMD_SOT95P280X135-5N; DB_APPROVED_ON: 07.05.2014 13:14:31; DB_DATASHEET: http://john.epiqdesign.com/projects/CIS_Datasheets/IC_BUXXTD3WG-TR.pdf?rev=1407&sc=0
U6 = PSU000000127: DB_PART_TYPE: Linear Voltage Regulator; DB_MANUFACTURER_PART: ROHM        BD33KA5WF-E2; DB_T_RANGE: -40 to 105; DB_VOLTAGE: 3.3V; DB_CURRENT: 500mA; DB_PACKAGE: SOIC-8; DB_DESCRIPTION: IC BD33KA5WF-E2 SOIC-8; DB_CERTIFIED: ISHIDDEN=T; DB_APPROVED_BY: VSN; DB_STATUS: NEW; DB_PART_NUMBER: PSU000000127; DB_PCB_DEVICE: SMD_SOIC127P620X160-8N; DB_APPROVED_ON: 07.05.2014 13:18:28; DB_DATASHEET: http://john.epiqdesign.com/projects/CIS_Datasheets/IC_bdxxka5wf-e-209388.pdf?rev=1408&sc=0
U7 = PSU000000129: DB_PART_TYPE: Linear Voltage Regulator; DB_MANUFACTURER_PART: ST       L7805CD2T-TR; NOTE: <NOTE>; DB_T_RANGE: 0 to 125; DB_VOLTAGE: 5V; DB_CURRENT: 1A; DB_PACKAGE: D2PAK; DB_DESCRIPTION: IC  L7805CD2T-TR  D2PAK; DB_CERTIFIED: ISHIDDEN=T; DB_APPROVED_BY: VSN; DB_STATUS: NEW; DB_PART_NUMBER: PSU000000129; DB_PCB_DEVICE: SMD_TO254P1542X460-3_4N; DB_APPROVED_ON: 07.05.2014 13:29:21; DB_DATASHEET: http://john.epiqdesign.com/projects/CIS_Datasheets/IC_L7805C.pdf?rev=1409&sc=0
U8 = PSU000000031: DB_PART_TYPE: Linear Voltage Regulator; DB_MANUFACTURER_PART: ON Semiconductor       MC78M05BDTRKG; NOTE: <NOTE>; DB_T_RANGE: -40 to 125; DB_VOLTAGE: 5V; DB_CURRENT: 500mA; DB_DROP_VOLTAGE: 2V; DB_PACKAGE: DPAK; DB_DESCRIPTION: IC  MC78M05BDTRKG  DPAK; DB_CERTIFIED: ISHIDDEN=T; DB_APPROVED_BY: VSN; DB_STATUS: NEW; DB_PART_NUMBER: PSU000000031; DB_PCB_DEVICE: SMD_TO229P991X239-4N_DPAK; DB_PRICE: ISHIDDEN=T; DB_LEADTIME: ISHIDDEN=T; DB_MOQ: ISHIDDEN=T; DB_PRICE_DATE: ISHIDDEN=T; DB_APPROVED_ON: 31.03.2011 10:50:15; DB_DATASHEET: http://john.epiqdesign.com/projects/CIS_Datasheets/MC78M00-D_ONSEMI.pdf?rev=192&sc=0
U9 U10 = PSU000000128: DB_PART_TYPE: Linear Voltage Regulator; DB_MANUFACTURER_PART: ROHM        BD00KA5WF-E2; DB_T_RANGE: -40 to 105; DB_VOLTAGE: 3.3V; DB_CURRENT: 500mA; DB_PACKAGE: SOIC-8; DB_DESCRIPTION: IC BD00KA5WF-E2 SOIC-8; DB_CERTIFIED: ISHIDDEN=T; DB_APPROVED_BY: VSN; DB_STATUS: NEW; DB_PART_NUMBER: PSU000000128; DB_PCB_DEVICE: SMD_SOIC127P620X160-8N; DB_APPROVED_ON: 07.05.2014 13:19:57; DB_DATASHEET: http://john.epiqdesign.com/projects/CIS_Datasheets/IC_bdxxka5wf-e-209388.pdf?rev=1408&sc=0
Y1 = OSC000000012: DB_PART_TYPE: Oscillator; DB_MANUFACTURER_PART: IQD       4.00MHz HC49/4HSMX; NOTE: <NOTE>; DB_ACCURACY: 100ppm; DB_T_RANGE: -10 to 60; DB_FREQUENCY: 4MHz; DB_PACKAGE: SMD; DB_DESCRIPTION: IC  4.00MHz HC49/4HSMX  SMD; DB_CERTIFIED: ISHIDDEN=T; DB_APPROVED_BY: VSN; DB_STATUS: NEW; DB_PART_NUMBER: OSC000000012; DB_PCB_DEVICE: SMD_HC49_XTAL1140X480X420N; DB_PRICE: ISHIDDEN=T; DB_LEADTIME: ISHIDDEN=T; DB_MOQ: ISHIDDEN=T; DB_PRICE_DATE: ISHIDDEN=T; DB_APPROVED_ON: 26.04.2012 15:32:29; DB_DATASHEET: http://john.epiqdesign.com/projects/CIS_Datasheets/hc49-4hsmx_IQD_oscillators.pdf?rev=713&sc=0